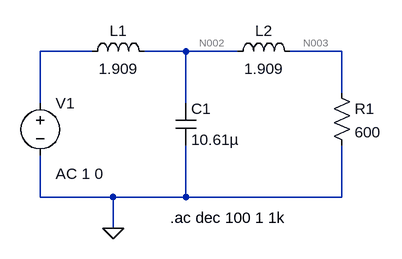
[diagram p0: schematic Filtro_T.asc]
Filtro_T.asc, the LTspice schematic file:
Version 4
SHEET 1 880 680
WIRE 128 32 48 32
WIRE 272 32 208 32
WIRE 352 32 272 32
WIRE 512 32 432 32
WIRE 512 96 512 32
WIRE 48 112 48 32
WIRE 272 112 272 32
WIRE 48 256 48 192
WIRE 160 256 48 256
WIRE 272 256 272 176
WIRE 272 256 160 256
WIRE 512 256 512 176
WIRE 512 256 272 256
WIRE 160 304 160 256
FLAG 160 304 0
SYMBOL voltage 48 96 R0
WINDOW 123 24 124 Left 2
WINDOW 39 0 0 Left 0
SYMATTR Value2 AC 1 0
SYMATTR InstName V1
SYMATTR Value ""
SYMBOL ind 112 48 R270
WINDOW 0 32 56 VTop 2
WINDOW 3 5 56 VBottom 2
SYMATTR InstName L1
SYMATTR Value 1.909
SYMBOL ind 336 48 R270
WINDOW 0 32 56 VTop 2
WINDOW 3 5 56 VBottom 2
SYMATTR InstName L2
SYMATTR Value 1.909
SYMBOL res 496 80 R0
SYMATTR InstName R1
SYMATTR Value 600
SYMBOL cap 256 112 R0
SYMATTR InstName C1
SYMATTR Value 10.61µ
TEXT 248 288 Left 2 !.ac dec 100 1 1k

The netlist it stands for:
* Filtro_T.asc
V1 N001 0 AC 1 0
L1 N001 N002 1.909
L2 N002 N003 1.909
R1 N003 0 600
C1 N002 0 10.61µ
.ac dec 100 1 1k
.backanno
.end

* Results of the author's LTspice run, read from the files saved beside the schematic
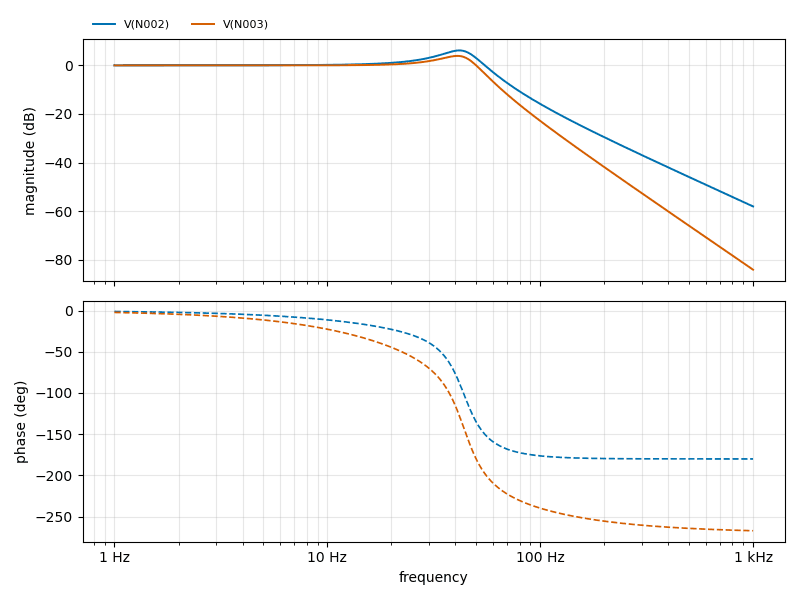
[diagram p1: AC Analysis of Filtro_T.asc, plotted from the saved traces]
* AC Analysis, 1 run:
*   V(N002): 0.00 dB at 1 Hz, -58.04 dB at 1 kHz, peak 6.16 dB at 41.69 Hz, 3 dB below the peak at 30.21 Hz and 49.78 Hz
*   V(N003): -0.00 dB at 1 Hz, -84.06 dB at 1 kHz, peak 3.90 dB at 40.74 Hz, 3 dB below the peak at 24.9 Hz and 48.7 Hz